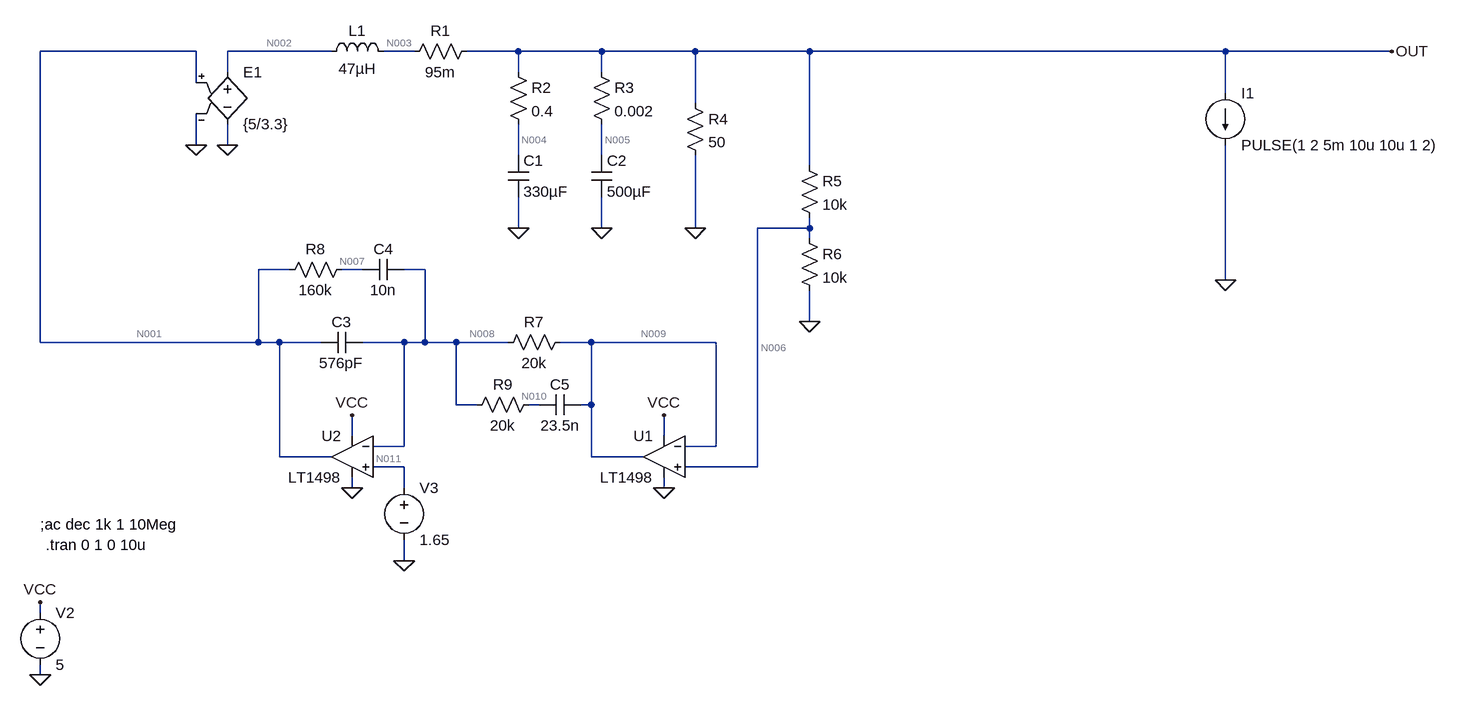
[diagram p0: schematic Digital_Buck_Converter_Type1_Transient_Model.asc]
Digital_Buck_Converter_Type1_Transient_Model.asc, the LTspice schematic file:
Version 4
SHEET 1 2016 1108
WIRE 48 128 -192 128
WIRE 256 128 96 128
WIRE 384 128 336 128
WIRE 544 128 464 128
WIRE 672 128 544 128
WIRE 816 128 672 128
WIRE 992 128 816 128
WIRE 1632 128 992 128
WIRE 1888 128 1632 128
WIRE 96 160 96 128
WIRE 544 160 544 128
WIRE 672 160 672 128
WIRE 48 176 48 128
WIRE 1632 192 1632 128
WIRE 816 208 816 128
WIRE 48 272 48 224
WIRE 96 272 96 240
WIRE 544 288 544 240
WIRE 672 288 672 240
WIRE 992 304 992 128
WIRE 544 400 544 352
WIRE 672 400 672 352
WIRE 816 400 816 288
WIRE 992 400 992 384
WIRE 992 400 912 400
WIRE 992 416 992 400
WIRE 192 464 144 464
WIRE 304 464 272 464
WIRE 400 464 368 464
WIRE 1632 480 1632 272
WIRE 992 544 992 496
WIRE -192 576 -192 128
WIRE 144 576 144 464
WIRE 144 576 -192 576
WIRE 176 576 144 576
WIRE 240 576 176 576
WIRE 368 576 304 576
WIRE 400 576 400 464
WIRE 400 576 368 576
WIRE 448 576 400 576
WIRE 528 576 448 576
WIRE 656 576 608 576
WIRE 848 576 656 576
WIRE 448 672 448 576
WIRE 480 672 448 672
WIRE 576 672 560 672
WIRE 656 672 656 576
WIRE 656 672 640 672
WIRE 288 720 288 688
WIRE 768 720 768 688
WIRE 368 736 368 576
WIRE 368 736 320 736
WIRE 848 736 848 576
WIRE 848 736 800 736
WIRE 176 752 176 576
WIRE 256 752 176 752
WIRE 656 752 656 672
WIRE 736 752 656 752
WIRE 368 768 320 768
WIRE 912 768 912 400
WIRE 912 768 800 768
WIRE 288 800 288 784
WIRE 368 800 368 768
WIRE 768 800 768 784
WIRE 368 912 368 880
WIRE -192 992 -192 976
WIRE -192 1088 -192 1072
FLAG 544 400 0
FLAG 672 400 0
FLAG 816 400 0
FLAG 1888 128 OUT
FLAG 992 544 0
FLAG 96 272 0
FLAG 48 272 0
FLAG 1632 480 0
FLAG -192 1088 0
FLAG -192 976 VCC
FLAG 768 800 0
FLAG 768 688 VCC
FLAG 288 800 0
FLAG 288 688 VCC
FLAG 368 912 0
SYMBOL ind 240 144 R270
WINDOW 0 32 56 VTop 2
WINDOW 3 5 56 VBottom 2
SYMATTR InstName L1
SYMATTR Value 47µH
SYMBOL res 480 112 R90
WINDOW 0 0 56 VBottom 2
WINDOW 3 32 56 VTop 2
SYMATTR InstName R1
SYMATTR Value 95m
SYMBOL cap 528 288 R0
SYMATTR InstName C1
SYMATTR Value 330µF
SYMBOL res 528 144 R0
SYMATTR InstName R2
SYMATTR Value 0.4
SYMBOL cap 656 288 R0
SYMATTR InstName C2
SYMATTR Value 500µF
SYMBOL res 656 144 R0
SYMATTR InstName R3
SYMATTR Value 0.002
SYMBOL res 800 192 R0
SYMATTR InstName R4
SYMATTR Value 50
SYMBOL res 976 288 R0
SYMATTR InstName R5
SYMATTR Value 10k
SYMBOL res 976 400 R0
SYMATTR InstName R6
SYMATTR Value 10k
SYMBOL e 96 144 R0
SYMATTR InstName E1
SYMATTR Value {5/3.3}
SYMBOL current 1632 192 R0
WINDOW 123 0 0 Left 0
WINDOW 39 0 0 Left 0
SYMATTR InstName I1
SYMATTR Value PULSE(1 2 5m 10u 10u 1 2)
SYMBOL voltage -192 976 R0
WINDOW 123 0 0 Left 0
WINDOW 39 0 0 Left 0
SYMATTR InstName V2
SYMATTR Value 5
SYMBOL voltage 368 784 R0
WINDOW 123 0 0 Left 0
WINDOW 39 0 0 Left 0
SYMATTR InstName V3
SYMATTR Value 1.65
SYMBOL res 624 560 R90
WINDOW 0 0 56 VBottom 2
WINDOW 3 32 56 VTop 2
SYMATTR InstName R7
SYMATTR Value 20k
SYMBOL cap 304 560 R90
WINDOW 0 0 32 VBottom 2
WINDOW 3 32 32 VTop 2
SYMATTR InstName C3
SYMATTR Value 576pF
SYMBOL Opamps\\LT1498 768 688 M0
SYMATTR InstName U1
SYMBOL Opamps\\LT1498 288 688 M0
SYMATTR InstName U2
SYMBOL res 288 448 R90
WINDOW 0 0 56 VBottom 2
WINDOW 3 32 56 VTop 2
SYMATTR InstName R8
SYMATTR Value 160k
SYMBOL cap 368 448 R90
WINDOW 0 0 32 VBottom 2
WINDOW 3 32 32 VTop 2
SYMATTR InstName C4
SYMATTR Value 10n
SYMBOL cap 640 656 R90
WINDOW 0 0 32 VBottom 2
WINDOW 3 32 32 VTop 2
SYMATTR InstName C5
SYMATTR Value 23.5n
SYMBOL res 576 656 R90
WINDOW 0 0 56 VBottom 2
WINDOW 3 32 56 VTop 2
SYMATTR InstName R9
SYMATTR Value 20k
TEXT -192 856 Left 2 !;ac dec 1k 1 10Meg
TEXT -184 888 Left 2 !.tran 0 1 0 10u

The netlist it stands for:
* Digital_Buck_Converter_Type1_Transient_Model.asc
L1 N002 N003 47µH
R1 OUT N003 95m
C1 N004 0 330µF
R2 OUT N004 0.4
C2 N005 0 500µF
R3 OUT N005 0.002
R4 OUT 0 50
R5 OUT N006 10k
R6 N006 0 10k
E1 N002 0 N001 0 {5/3.3}
I1 OUT 0 PULSE(1 2 5m 10u 10u 1 2)
V2 VCC 0 5
V3 N011 0 1.65
R7 N009 N008 20k
C3 N008 N001 576pF
XU1 N006 N009 VCC 0 N009 LT1498  ; pins In+ In- V+ V- OUT
XU2 N011 N008 VCC 0 N001 LT1498  ; pins In+ In- V+ V- OUT
R8 N007 N001 160k
C4 N008 N007 10n
C5 N009 N010 23.5n
R9 N010 N008 20k
;ac dec 1k 1 10Meg
.tran 0 1 0 10u
.lib LTC.lib
.backanno
.end

* Results of the author's LTspice run, read from the files saved beside the schematic
* Operating Point, zero values left out:
*   V(n002) = 3.39 V
*   V(n003) = 3.389 V
*   V(out) = 3.287 V
*   V(n004) = 3.287 V
*   V(n005) = 3.287 V
*   V(n006) = 1.645 V
*   V(n001) = 2.237 V
*   V(vcc) = 5 V
*   V(n011) = 1.65 V
*   V(n009) = 1.645 V
*   V(n008) = 1.65 V
*   V(n007) = 2.237 V
*   V(n010) = 1.65 V
*   I(L1) = 1.066 A
*   I(I1) = 1 A
*   I(R7) = -251.8 nA
*   I(R6) = 164.5 µA
*   I(R5) = 164.2 µA
*   I(R4) = 65.75 mA
*   I(R1) = -1.066 A
*   I(E1) = -1.066 A
*   I(V3) = 251.8 nA
*   I(V2) = -3.401 mA
*   Ix(u1:1) = -251.8 nA
*   Ix(u1:2) = -251.8 nA
*   Ix(u1:3) = 1.7 mA
*   Ix(u1:4) = -1.7 mA
*   Ix(u1:5) = 503.5 nA
*   Ix(u2:1) = -251.8 nA
*   Ix(u2:2) = -251.8 nA
*   Ix(u2:3) = 1.7 mA
*   Ix(u2:4) = -1.7 mA